# EAGLE schematic schimmeliger_keller (EAGLE 7.6.0)
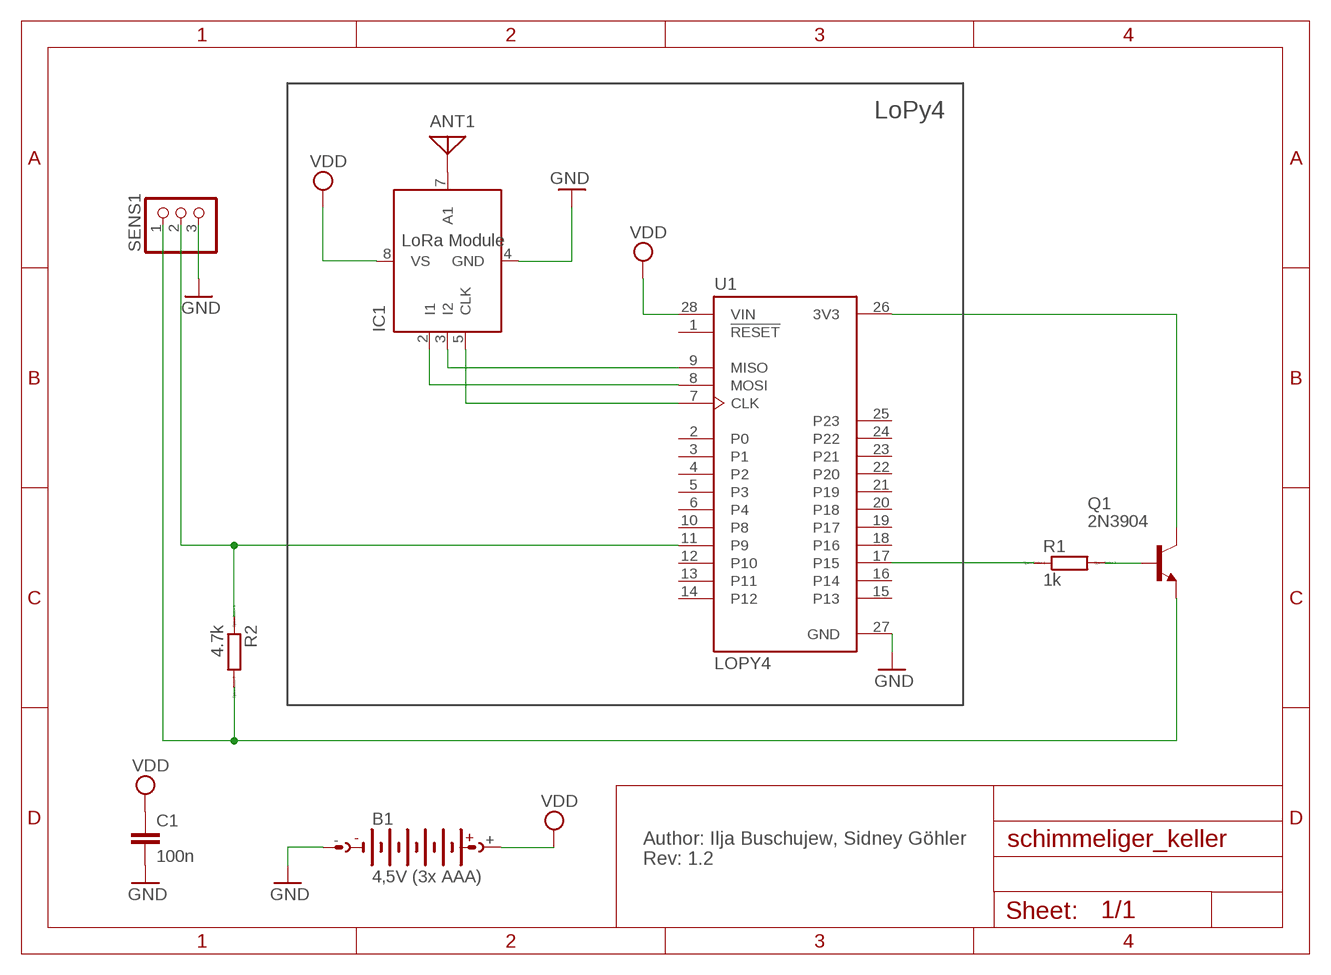
[diagram p0: schematic, sheet 1]

## Parts
ANT1  ANTENNA  [PAD-01]
B1  4,5V (3x AAA)  AB9V  [AB9V]
C1  100n  C10/4  [C10B4]
IC1  LoRa Module  U893BSE  [DIL08]
Q1  2N3904  [TO92]
R1  1k  R0204/7  [0204/7]
R2  4.7k  R0204/7  [0204/7]
SENS1  PINHD-1X3  [1X03]
U1  LOPY4  [MODULE_LOPY4]

## Nets
GND: B1.- C1.2 IC1.4(GND) SENS1.3 U1.27(GND)
N$1: Q1.1(C) U1.26(3V3)
N$2: Q1.3(E) R2.2 SENS1.1
N$3: R2.1 SENS1.2 U1.11(P9)
N$4: R1.1 U1.17(P15)
N$5: ANT1.1 IC1.7(A1)
N$6: Q1.2(B) R1.2
N$8: IC1.5(CLK) U1.7(CLK)
N$9: IC1.2(I1) U1.8(MOSI)
N$10: IC1.3(I2) U1.9(MISO)
VDD: B1.+ C1.1 IC1.8(VS) U1.28(VIN)
Unconnected: U1.1(!RESET) U1.2(P0) U1.3(P1) U1.4(P2) U1.5(P3) U1.6(P4) U1.10(P8) U1.12(P10) U1.13(P11) U1.14(P12) U1.15(P13) U1.16(P14) U1.18(P16) U1.19(P17) U1.20(P18) U1.21(P19) U1.22(P20) U1.23(P21) U1.24(P22) U1.25(P23)

## Notes on the sheet
- LoPy4
- Author: Ilja Buschujew, Sidney Göhler
  Rev: 1.2

## Library data of the parts
ANT1 = discrete:ANTENNA: Antenna
B1 = battery:AB9V: 9-V BATTERY CLIP
C1 = capacitor-wima:C: CAPACITOR naming: grid - package width
IC1 = blubb:U893BSE: 1.3 GHz Prescaler for PLL?s in TV, CATV and SAT TV Tuners Source: TELEFUNKEN .. U893.pdf; OC_FARNELL: unknown; OC_NEWARK: unknown
Q1 = transistor:2N3904: NPN TRANSISTOR
R1 R2 = eagle-ltspice:R: RESISTOR, European symbol; SPICEMODEL: NONE; SPICEPREFIX: R
SENS1 = pinhead:PINHD-1X3: PIN HEADER
U1 = LOPY4:LOPY4: ESP32, L04 - Transceiver; 802.11 b/g/n (Wi-Fi, WiFi, WLAN), Bluetooth Smart Ready 4.x Dual Mode, LoRa (LoRaWAN), Sigfox Evaluation Board Check availability <https://pricing.snapeda.com/parts/LOPY4/Pycom%20Ltd./view-part?ref=eda>; AVAILABILITY: Not in stock; DESCRIPTION: ESP32, L04 series Transceiver; 802.11 b/g/n (Wi-Fi, WiFi, WLAN), Bluetooth® Smart Ready 4.x Dual Mode, LoRa® (LoRaWAN™), Sigfox Evaluation Board; MF: Pycom Ltd.; MP: LOPY4; PACKAGE: None; PRICE: None